# EAGLE design SESSION 5 (EAGLE 9.6.2)
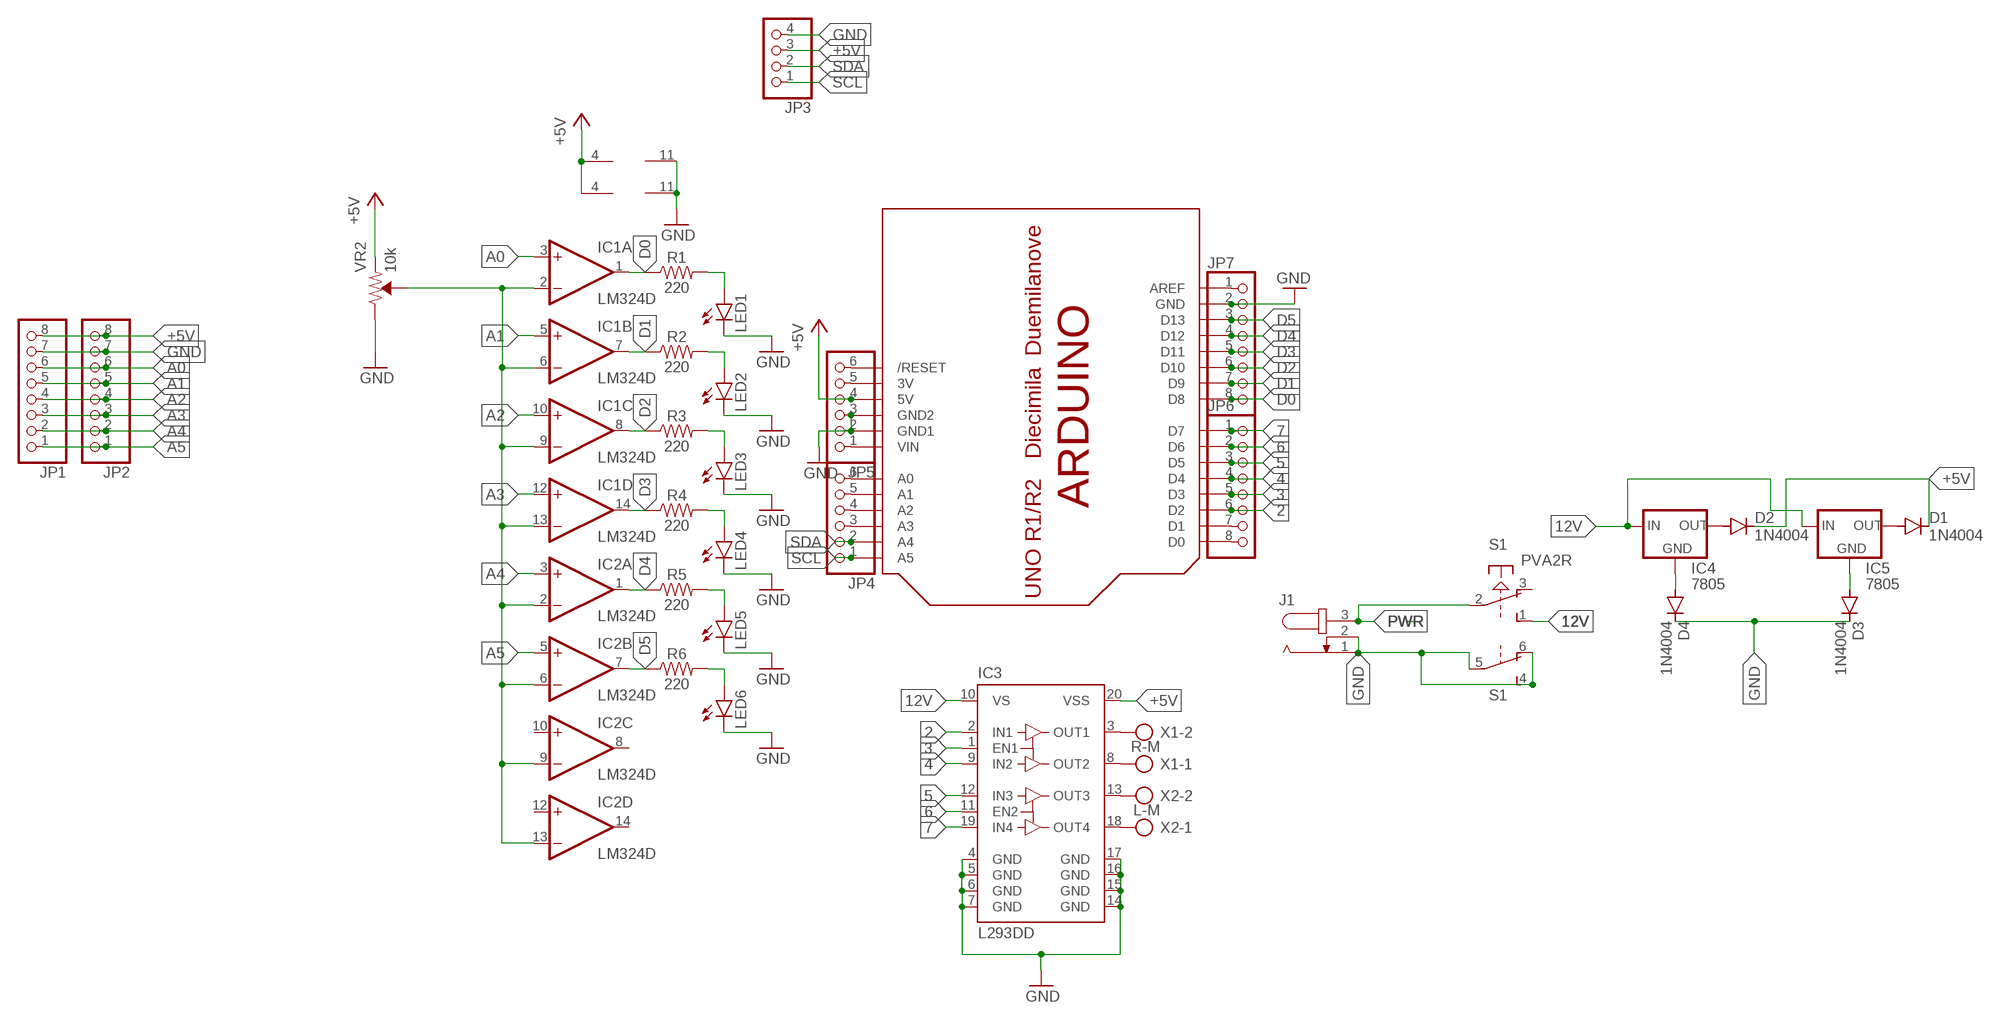
[diagram p0: schematic, sheet 1]

## Parts
D1  1N4004  [DO41-10]
D2  1N4004  [DO41-10]
D3  1N4004  [DO41-10]
D4  1N4004  [DO41-10]
IC1  LM324D  [SO14]
IC2  LM324D  [SO14]
IC3  L293DD  [SO20]
IC4  7805  78XXS  [78XXS]
IC5  7805  78XXS  [78XXS]
J1  JACK-PLUG1  [SPC4078]
JP1  PINHD-1X8  [1X08]
JP2  PINHD-1X8  [1X08]
JP3  PINHD-1X4  [1X04]
JP4  PINHD-1X6  [1X06]
JP5  PINHD-1X6  [1X06]
JP6  PINHD-1X8  [1X08]
JP7  PINHD-1X8  [1X08]
LED1  LEDCHIPLED_0805  [CHIPLED_0805]
LED2  LEDCHIPLED_0805  [CHIPLED_0805]
LED3  LEDCHIPLED_0805  [CHIPLED_0805]
LED4  LEDCHIPLED_0805  [CHIPLED_0805]
LED5  LEDCHIPLED_0805  [CHIPLED_0805]
LED6  LEDCHIPLED_0805  [CHIPLED_0805]
R1  220  RESISTOR1206  [1206]
R2  220  RESISTOR1206  [1206]
R3  220  RESISTOR1206  [1206]
R4  220  RESISTOR1206  [1206]
R5  220  RESISTOR1206  [1206]
R6  220  RESISTOR1206  [1206]
S1  PVA2R  [PVA2R]
U$1  ARDUINO-NODIM  [ARDUINO-NODIM]
VR2  10k  TRIMPOT-PTH-10MM-KNOB-1/2W-10%  [TRIMPOT-PTH-3386U]
X1  R-M  AK500/2-H  [AK500/2-H]
X2  L-M  AK500/2-H  [AK500/2-H]

## Nets
2: IC3.2(IN1) JP6.6 U$1.D2
3: IC3.1(EN1) JP6.5 U$1.D3
4: IC3.9(IN2) JP6.4 U$1.D4
5: IC3.12(IN3) JP6.3 U$1.D5
6: IC3.11(EN2) JP6.2 U$1.D6
7: IC3.19(IN4) JP6.1 U$1.D7
12V: IC3.10(VS) IC4.IN IC5.IN S1.1(1:S)
+5V: D1.C D2.C IC1.4(P:V+) IC2.4(P:V+) IC3.20(VSS) JP1.8 JP2.8 JP3.3 JP5.4 U$1.5V VR2.1(CCW)
A0: IC1.3(A:+IN) JP1.6 JP2.6
A1: IC1.5(B:+IN) JP1.5 JP2.5
A2: IC1.10(C:+IN) JP1.4 JP2.4
A3: IC1.12(D:+IN) JP1.3 JP2.3
A4: IC2.3(A:+IN) JP1.2 JP2.2
A5: IC2.5(B:+IN) JP1.1 JP2.1
D0: IC1.1(A:OUT) JP7.8 R1.1 U$1.D8
D1: IC1.7(B:OUT) JP7.7 R2.1 U$1.D9
D2: IC1.8(C:OUT) JP7.6 R3.1 U$1.D10
D3: IC1.14(D:OUT) JP7.5 R4.1 U$1.D11
D4: IC2.1(A:OUT) JP7.4 R5.1 U$1.D12
D5: IC2.7(B:OUT) JP7.3 R6.1 U$1.D13
GND: D3.C D4.C IC1.11(P:V-) IC2.11(P:V-) IC3.4(GND) IC3.5(GND) IC3.6(GND) IC3.7(GND) IC3.14(GND) IC3.15(GND) IC3.16(GND) IC3.17(GND) J1.1 J1.2 JP1.7 JP2.7 JP3.4 JP5.2 JP5.3 JP7.2 LED1.C LED2.C LED3.C LED4.C LED5.C LED6.C S1.4(2:S) S1.5(2:P) S1.6(2:O) U$1.GND U$1.GND1 U$1.GND2 VR2.3(CW)
N$1: LED1.A R1.2
N$2: IC3.8(OUT2) X1.1
N$3: IC3.3(OUT1) X1.2
N$4: LED2.A R2.2
N$5: IC3.18(OUT4) X2.1
N$6: LED3.A R3.2
N$7: IC3.13(OUT3) X2.2
N$8: LED4.A R4.2
N$10: LED5.A R5.2
N$11: D1.A IC5.OUT
N$12: LED6.A R6.2
N$13: D2.A IC4.OUT
N$14: D4.A IC4.GND
N$15: IC1.2(A:-IN) IC1.6(B:-IN) IC1.9(C:-IN) IC1.13(D:-IN) IC2.2(A:-IN) IC2.6(B:-IN) IC2.9(C:-IN) IC2.13(D:-IN) VR2.2(WIPER)
N$16: D3.A IC5.GND
N$17: JP4.3 U$1.A3
N$18: JP4.4 U$1.A2
N$19: JP4.5 U$1.A1
N$20: JP4.6 U$1.A0
N$22: JP5.1 U$1.VIN
N$23: JP5.5 U$1.3V
N$24: JP5.6 U$1.RESET(/RESET)
N$25: JP6.7 U$1.D1
N$26: JP6.8 U$1.D0
N$27: JP7.1 U$1.AREF
PWR: J1.3 S1.2(1:P)
SCL: JP3.1 JP4.1 U$1.A5
SDA: JP3.2 JP4.2 U$1.A4
Unconnected: IC2.8(C:OUT) IC2.10(C:+IN) IC2.12(D:+IN) IC2.14(D:OUT) S1.3(1:O)

## Library data of the parts
D1-D4 = diode:1N4004: DIODE general purpose rectifier, 1 A
IC1 IC2 = linear:LM324: OP AMP
IC3 = st-microelectronics:L293DD: PUSH-PULL FOUR CHANNEL DRIVER WITH DIODES Source: http://www.st.com/stonline/books/pdf/docs/1330.pdf; OC_FARNELL: unknown
IC4 IC5 = v-reg:78XXS: VOLTAGE REGULATOR
J1 = con-jack:JACK-PLUG: DC POWER JACK Power Jack, DC, Right Angle, Through Hole, Rated 5A at 16VDC, PC Terminals Distributor: Farnell (www.Farnell.de) Drawing: 84N1161.pdf / 84N1162.pdf Manufacturer: SPC Technology (www.spctechnology.com) Type: SPC4077 / SPC 4078; OC_FARNELL: unknown; OC_NEWARK: unknown
JP1 JP2 JP6 JP7 = pinhead:PINHD-1X8: PIN HEADER
JP3 = pinhead:PINHD-1X4: PIN HEADER
JP4 JP5 = pinhead:PINHD-1X6: PIN HEADER
LED1-LED6 = led:LED: LED OSRAM: - CHIPLED LG R971, LG N971, LY N971, LG Q971, LY Q971, LO R971, LY R971 LH N974, LH R974 LS Q976, LO Q976, LY Q976 LO Q996 - Hyper CHIPLED LW Q18S LB Q993, LB Q99A, LB R99A - SideLED LS A670, LO A670, LY A670, LG A670, LP A670 LB A673, LV A673, LT A673, LW A673 LH A674 LY A675 LS A676, LA A676, LO A676, LY A676, LW A676 LS A679, LY A679, LG A679 - Hyper Micro SIDELED® LS Y876, LA Y876, LO Y876, LY Y876 LT Y87S - SmartLED LW L88C, LW L88S LB L89C, LB L89S, LG L890 LS L89K, LO L89K, LY L89K LS L896, LA L896, LO L896, LY L896 - TOPLED LS T670, LO T670, LY T670, LG T670, LP T670 LSG T670, LSP T670, LSY T670, LOP T670, LYG T670 LG T671, LOG T671, LSG T671 LB T673, LV T673, LT T673, LW T673 LH T674 LS T676, LA T676, LO T676, LY T676, LB T676, LH T676, LSB T676, LW T676 LB T67C, LV T67C, LT T67C, LS T67K, LO T67K, LY T67K, LW E67C LS E67B, LA E67B, LO E67B, LY E67B, LB E67C, LV E67C, LT E67C LW T67C LS T679, LY T679, LG T679 LS T770, LO T770, LY T770, LG T770, LP T770 LB T773, LV T773, LT T773, LW T773 LH T774 LS E675, LA E675, LY E675, LS T675 LS T776, LA T776, LO T776, LY T776, LB T776 LHGB T686 LT T68C, LB T68C - Hyper Mini TOPLED® LB M676 - Mini TOPLED Santana® LG M470 LS M47K, LO M47K, LY M47K Source: http://www.osram.convergy.de LUXEON: - LUMILED® LXK2-PW12-R00, LXK2-PW12-S00, LXK2-PW14-U00, LXK2-PW14-V00 LXK2-PM12-R00, LXK2-PM12-S00, LXK2-PM14-U00 LXK2-PE12-Q00, LXK2-PE12-R00, LXK2-PE12-S00, LXK2-PE14-T00, LXK2-PE14-U00 LXK2-PB12-K00, LXK2-PB12-L00, LXK2-PB12-M00, LXK2-PB14-N00, LXK2-PB14-P00, LXK2-PB14-Q00 LXK2-PR12-L00, LXK2-PR12-M00, LXK2-PR14-Q00, LXK2-PR14-R00 LXK2-PD12-Q00, LXK2-PD12-R00, LXK2-PD12-S00 LXK2-PH12-R00, LXK2-PH12-S00 LXK2-PL12-P00, LXK2-PL12-Q00, LXK2-PL12-R00 Source: www.luxeon.com KINGBRIGHT: KA-3528ASYC Source: www.kingbright.com
R1-R6 = SparkFun-Resistors:RESISTOR: Generic Resistor Package
S1 = switch-misc:PVA2R: ITT SWITCH
U$1 = adafruit:ARDUINO: Arduino Diecimila/Duemilanove Make a shield with ease, this package has all the named pins as well as the two mounting drill holes and an outline of the USB and DC power connector. The outline is on the DIMENSION layer, so if your board house uses it they will cut the outline to match. http://www.ladyada.net/library/pcb/eaglelibrary.html
VR2 = SparkFun-Resistors:TRIMPOT: Trimming Potentiometer (Trimpot) Three-terminal potentiometers, with an adjustable wiper and two adjustable resistors. A pot can be used to create a configurable voltage divider, or as a variable resistor. "Trimpots" are a subset of potentiometers, usually intended for "set-and-forget" applications. They're often more delicate than standard potentiometers - rated for fewer turns. Variants PTH-KNOB - PTH Trimpot w/ finger-adjustable knob Trimpot 10K with Knob <https://www.sparkfun.com/products/9806> (COM-09806) Datasheet <http://www.sparkfun.com/datasheets/Components/General/TSR-3386.pdf> SMD-3MM-CLOSED-FRAME - SMD 3mm Square Closed-Frame Trimpot Used on e.g. EasyDriver - Stepper Motor Driver <https://www.sparkfun.com/products/12779> Datasheet <http://www.bitechnologies.com/pdfs/22.pdf> (22AR10KTR) SMD-5MM - SMD 5mm Square Closed-Frame Trimpot Used on e.g. IOIO-OTG - V2.2 <https://www.sparkfun.com/products/13613> Datasheet <http://www.vishay.com/docs/51008/ts53.pdf> (TS53YL502MR10) SMD-3MM-1/10W-25% - 3mm Square Open-Frame Trimpot Used on e.g. SparkFun Shapeoko <https://www.sparkfun.com/products/13899> Datasheet <http://www.bourns.com/docs/Product-Datasheets/TC33.pdf> (TC33X-2-103E); PROD_ID: RES-09730; SF_SKU: COM-09806
X1 X2 = con-ptr500:AK500/2-H: CONNECTOR Aug. 2004 / PTR Meßtechnik: Die Bezeichnung der Serie AK505 wurde geändert. Es handelt sich hierbei um AK500 in horizontaler Ausführung.; OC_FARNELL: unknown; OC_NEWARK: unknown

## Board
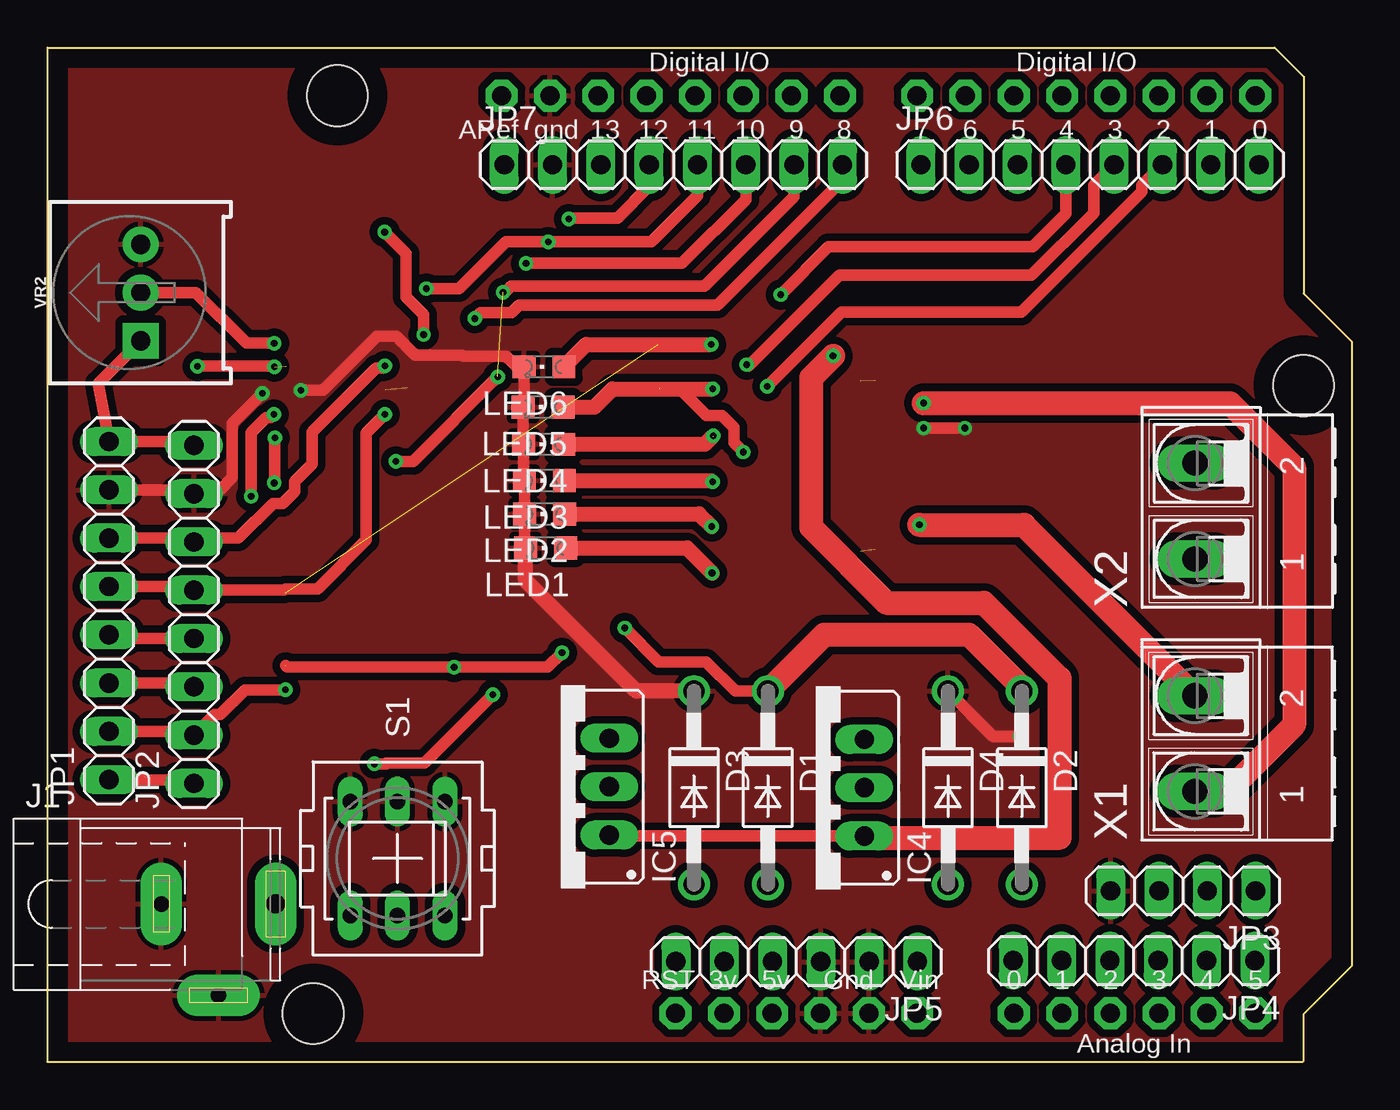
[diagram p1: board, top side]
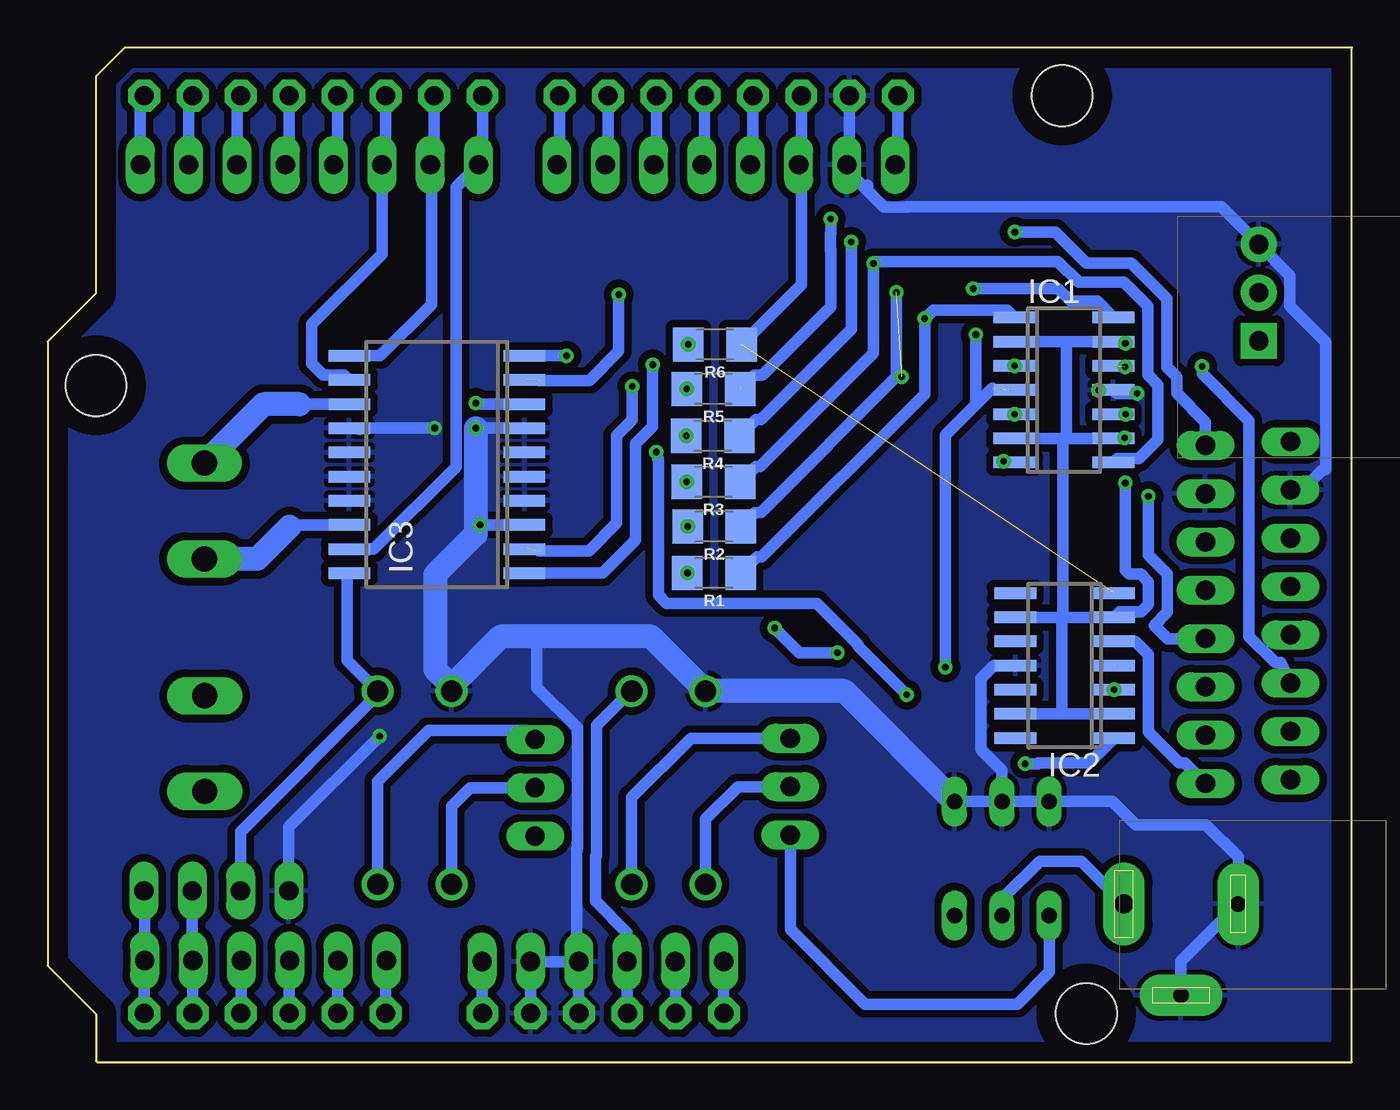
[diagram p2: board, bottom side, seen from below]

Size 68.58 x 53.35 mm. Coordinates in mm from the lower left corner, seen from the top.
Outline: 0,53.35 64.51,53.35 66.03,51.84 66.04,51.84 66.04,40.41 68.57,37.88 68.58,37.88 68.58,5.08 68.58,5.08 66.02,2.52 66.02,0.06 65.96,0 0,0 0,0 0,53.33 0.01,53.34 0.02,53.33 0.02,53.33
Copper layers (1*16): Top 0.035mm / dielectric 1.5mm / Bottom 0.035mm
Design rules "default *": minimum track width 0.6mm, minimum drill 0.2mm, track to track 0.4mm, track to pad 0.4mm, pad to pad 0.4mm, via to via 0.4mm, smd to smd 0.4mm, copper to edge 40mil, drill to drill 6mil, minimum pad ring 10mil, minimum via ring 8mil, stop-mask expansion 4mil, vias tented up to drill 0mil, thermal gap 10mil

### Footprints (pad centres in the part's own frame; a part is rotated, then mirrored left to right if it is on the bottom)
DO41-10 = drill 1.118: A 5.08,0; C -5.08,0
SO14 = smd 0.6 x 2.2: 1 -3.81,-2.6; 2 -2.54,-2.6; 3 -1.27,-2.6; 4 0,-2.6; 5 1.27,-2.6; 6 2.54,-2.6; 7 3.81,-2.6; 8 3.81,2.6; 9 2.54,2.6; 10 1.27,2.6; 11 0,2.6; 12 -1.27,2.6; 13 -2.54,2.6; 14 -3.81,2.6
SO20 = smd 0.6 x 2.2: 1 -5.715,-4.6; 2 -4.445,-4.6; 3 -3.175,-4.6; 4 -1.905,-4.6; 5 -0.635,-4.6; 6 0.635,-4.6; 7 1.905,-4.6; 8 3.175,-4.6; 9 4.445,-4.6; 10 5.715,-4.6; 11 5.715,4.6; 12 4.445,4.6; 13 3.175,4.6; 14 1.905,4.6; 15 0.635,4.6; 16 -0.635,4.6; 17 -1.905,4.6; 18 -3.175,4.6; 19 -4.445,4.6; 20 -5.715,4.6
78XXS = drill 1.016 long: GND 0,-2.54; IN -2.54,-2.54; OUT 2.54,-2.54
SPC4078 = drill 0.8 pad 2.184 long: 1 -3,0; 2 0,-4.8 | drill 1 pad 2.184 long: 3 3,0
1X08 = drill 1.016 long: 1 -8.89,0; 2 -6.35,0; 3 -3.81,0; 4 -1.27,0; 5 1.27,0; 6 3.81,0; 7 6.35,0; 8 8.89,0
1X04 = drill 1.016 long: 1 -3.81,0; 2 -1.27,0; 3 1.27,0; 4 3.81,0
1X06 = drill 1.016 long: 1 -6.35,0; 2 -3.81,0; 3 -1.27,0; 4 1.27,0; 5 3.81,0; 6 6.35,0
CHIPLED_0805 = smd 1.2 x 1.2: A 0,-1.05; C 0,1.05
1206 = smd 1.6 x 1.8: 1 -1.4,0; 2 1.4,0
PVA2R = drill 0.813 long: 1 -2.997,2.489; 2 -2.997,0; 3 -2.997,-2.489; 4 2.997,2.489; 5 2.997,0; 6 2.997,-2.489
ARDUINO-NODIM = drill 1 pad 1.676 octagon: 3V 35.56,2.54; 5V 38.1,2.54; A0 50.8,2.54; A1 53.34,2.54; A2 55.88,2.54; A3 58.42,2.54; A4 60.96,2.54; A5 63.5,2.54; AREF 23.876,50.8; D0 63.5,50.8; D1 60.96,50.8; D2 58.42,50.8; D3 55.88,50.8; D4 53.34,50.8; D5 50.8,50.8; D6 48.26,50.8; D7 45.72,50.8; D8 41.656,50.8; D9 39.116,50.8; D10 36.576,50.8; D11 34.036,50.8; D12 31.496,50.8; D13 28.956,50.8; GND 26.416,50.8; GND1 43.18,2.54; GND2 40.64,2.54; RESET 33.02,2.54; VIN 45.72,2.54 | hole 3.2: 15.24,50.8; 66.04,35.56; 13.97,2.54
TRIMPOT-PTH-3386U = drill 1.016 pad 1.88 square: 1 -2.54,-0.015 | drill 1.016 pad 1.88: 2 0,-0.015; 3 2.54,-0.015
AK500/2-H = drill 1.321 long: 1 -2.515,0; 2 2.515,0

### Placement (x,y rotation side)
D1  37.87,14.43 270 top
D2  51.22,14.43 270 top
D3  33.98,14.43 270 top
D4  47.34,14.43 270 top
IC1  15.14,35.35 270 bottom
IC2  15.1,20.86 90 bottom
IC3  48.11,31.43 90 bottom
IC4  40.4,14.43 90 top
IC5  26.99,14.49 90 top
J1  8.98,8.32 0 top
JP1  3.23,23.74 90 top
JP2  7.7,23.55 90 top
JP3  59.7,9.02 180 top
JP4  57.12,5.34 180 top
JP5  39.38,5.29 180 top
JP6  54.81,47.19 0 top
JP7  32.9,47.19 0 top
LED1  26.19,27.04 90 top
LED2  26.13,28.83 90 top
LED3  26.12,30.58 90 top
LED4  26.07,32.49 90 top
LED5  26.05,34.44 90 top
LED6  26.09,36.56 90 top
R1  33.53,25.72 180 bottom
R2  33.53,28.17 180 bottom
R3  33.56,30.51 180 bottom
R4  33.6,32.93 180 bottom
R5  33.56,35.4 180 bottom
R6  33.49,37.74 180 bottom
S1  18.4,10.71 90 top
U$1  0,0.02 0 top
VR2  4.89,40.47 90 top
X1  60.31,16.76 90 top
X2  60.33,28.98 90 top

### Tracks (layer width: path | path; a pad name or v marks a point on that pad's centre or on a via)
2  (via drill 0.35)  (1 unrouted)
  Top 0.6: JP6.6 57.54,46.11 57.54,45.78 51.2,39.44 41.74,39.44 v37.84,35.55
  Bottom 0.6: U$1.D2 58.62,50.62 JP6.6 | 42.73,26.88 40.12,26.88 38.66,28.35 38.66,32.95 37.84,33.76 v37.84,35.55
3  (via drill 0.35)
  Top 0.6: JP6.5 55,46.11 55,44.66 51.73,41.38 41.62,41.38 36.86,36.62 36.83,36.62 v36.76,36.68
  Bottom 0.6: U$1.D3 55.88,47.39 JP6.5 | IC3.1 39.39,25.71 37.66,27.45 37.66,32.53 36.76,33.43 v36.76,36.68
4  (via drill 0.35)  (1 unrouted)
  Top 0.6: JP6.4 53.54,44.61 51.81,42.88 41.07,42.88 v38.55,40.36 | v38.55,40.36
  Bottom 0.6: U$1.D4 53.34,47.39 JP6.4 | v38.55,40.36 38.55,37.38 40.08,35.85 42.75,35.85
5
  Bottom 0.6: U$1.D5 50.8,47.39 JP6.3 51,42.49 54.69,38.8 54.69,36.73 54.1,36.14 52.98,36.14 IC3.12
6
  Bottom 0.6: 48.4,47.13 JP6.2 | U$1.D6 48.26,47.27 48.4,47.13 | IC3.11 51.09,37.14 48.4,39.84 48.4,47.13
7
  Bottom 0.6: U$1.D7 45.72,47.39 JP6.1 47.11,46 47.11,31.3 51.43,26.98 IC3.19
12V  (via drill 0.35)
  Top 0.6: IC4.IN 29.59,11.89 IC5.IN
  Top 1.27: v41.29,37.14 40.14,35.98 40.14,28.13 44.11,24.16 49.23,24.16 53.2,20.19 53.2,11.8 43.04,11.8 IC4.IN
  Bottom 0.6: IC3.10 v41.3,37.14 v41.29,37.14 | S1.1 15.91,4.75 17.6,3.05 25.6,3.05 29.53,6.98 IC5.IN
+5V  (via drill 0.35)  (2 unrouted)
  Top 0.6: JP2.8 7.5,32.63 JP1.8 2.67,35.69 VR2.1 | v30.35,22.83 32.13,21.05 34.62,21.05 36.16,19.51 D1.C | 12.51,20.85 12.59,20.78 v21.37,20.78 26.29,20.78 v27.05,21.53 | v17.72,43.65 18.85,42.53 18.85,40.23 19.77,39.3 v19.77,38.26
  Top 1.27: D1.C 40.84,22.49 48.44,22.49 51.22,19.7 D2.C
  Bottom 0.6: IC3.20 52.83,25.59 52.83,21.12 D2.C 51.22,19.33 58.43,12.12 JP3.3 | U$1.5V 38.11,2.58 JP5.4 38.11,6.81 39.78,8.48 39.78,10.82 39.72,10.87 39.72,17.7 37.91,19.51 D1.C | v21.37,20.78 21.37,32.97 19.77,34.58 | 19.77,34.58 18.9,35.44 | v27.05,21.53 29.04,21.53 v30.35,22.83 | JP2.8 7.7,33.66 9.21,35.17 9.21,36.03 9.74,36.56 9.74,40.16 11.59,42.01 13.95,42.01 15.6,43.65 v17.72,43.65 | v19.77,38.26 19.77,34.58
  other vias: 7.7,32.44
A0  (via drill 0.35)
  Top 0.6: JP1.6 7.5,27.55 | 7.5,27.55 JP2.6 | IC1.3 17.62,36.49 17.27,36.49 13.92,33.14 13.92,31.45 12.99,30.52 12.99,30.01 12.36,29.38 11.85,29.38 10.02,27.55 7.5,27.55
  other vias: 17.74,36.62
A1  (via drill 0.35)
  Top 0.6: JP1.5 7.63,25.01 JP2.5 12.45,24.82 12.52,24.9 14.2,24.9 16.75,27.45 16.75,33.09 IC1.5
  other vias: 17.74,34.08
A2  (via drill 0.35)
  Top 0.6: JP1.4 2.86,22.28 JP2.4 | v11.9,34.07 11.73,33.9 11.5,33.9 10.71,33.11 v10.71,29.76
  Bottom 0.6: IC1.10 v11.9,34.07 | JP2.4 7.71,22.26 9.69,22.26 10.4,22.97 9.7,23.66 9.7,25.67 10.71,26.68 v10.71,29.76
A3  (via drill 0.35)  (1 unrouted)
  Top 0.6: JP1.3 7.5,19.93 JP2.3 | v7.88,36.59 11.9,36.59 v11.93,36.56
  Bottom 0.6: v7.88,36.59 7.88,36.21 5.42,33.74 5.42,22.39 4.03,21.01 3.75,21.01 JP1.3
A4  (via drill 0.35)
  Top 0.6: JP1.2 7.5,17.39 JP2.2 8.77,18.28 9.06,18.28 10.38,19.59 IC2.3
  other vias: 12.5,19.59
A5
  Top 0.6: JP1.1 7.5,14.85 JP2.1
  Bottom 0.6: JP2.1 8.77,15.74 9.06,15.74 10.7,17.37 10.7,21.45 11.38,22.13 IC2.5
D0  (via drill 0.35)
  Top 0.6: v22.46,39.1 22.76,39.41 24.39,39.41 24.79,39.8 35.22,39.8 41.79,46.37 JP7.8
  Bottom 0.6: U$1.D8 41.65,47.33 JP7.8 | R1.1 31.29,26.57 31.04,26.57 22.46,35.14 v22.46,39.1 22.01,39.55 18.14,39.55 IC1.1
D1  (via drill 0.35)  (1 unrouted)
  Top 0.6: JP7.7 39.25,45.51 34.54,40.8 24.38,40.8 24.06,40.48 v23.95,40.48 | v18.31,31.59 19.22,31.59 v23.67,36.04
  Bottom 0.6: U$1.D9 39.11,47.33 JP7.7 | R2.1 31.38,28.91 31.07,28.91 23.95,36.04 v23.95,40.48 | IC1.7 18.25,31.54 v18.31,31.59
D2  (via drill 0.35)
  Top 0.6: v25.16,42.01 33.37,42.01 36.71,45.36 JP7.6
  Bottom 0.6: U$1.D10 36.57,47.33 JP7.6 | R3.1 31.34,31.33 31.11,31.33 25.16,37.29 v25.16,42.01 25.07,42.11 15.47,42.11 14.37,41.01 12,41.01 10.74,39.75 10.74,36.15 10.21,35.62 10.21,32.75 11.21,31.75 12.33,31.75 IC1.8
D3  (via drill 0.35)
  Top 0.6: JP7.5 34.17,45.55 31.75,43.13 v26.33,43.13 24.11,43.13 21.65,40.68 v19.92,40.68
  Bottom 0.6: U$1.D11 34.03,47.33 JP7.5 | R4.1 31.34,33.8 31.07,33.8 26.33,38.55 v26.33,43.13 | IC1.14 13.39,40.01 14.78,40.01 15.45,40.68 v19.92,40.68
D4  (via drill 0.35)  (1 unrouted)
  Top 0.6: v27.4,44.35 27.45,44.39 29.96,44.39 31.63,46.06 JP7.4 | v17.17,15.69 17.79,15.69 17.84,15.73 19.82,15.73 v23.41,19.33 | 32.17,35.45 33.21,35.45 34.65,34.01 35.45,34.01 36.08,33.38 36.08,32.59 v36.58,32.09
  Bottom 0.6: U$1.D12 31.49,47.33 JP7.4 | R5.1 31.42,36.14 31,36.14 27.4,39.74 27.4,42.69 27.4,43.58 v27.4,44.35 | v17.17,15.69 16.52,15.69 16.47,15.73 13.82,15.73 IC2.1 | v23.41,19.33 25.97,21.89 25.97,21.98 28.12,24.12 36.02,24.12 36.46,24.56 36.46,31.71 36.5,31.74 36.5,32.01 v36.58,32.09
D5  (1 unrouted)
  Bottom 0.6: U$1.D13 28.95,47.33 | 28.95,47.33 JP7.3 | R6.1 28.95,40.88 28.95,47.33
GND  (via drill 0.35)
  Top 0.6: JP1.7 7.5,30.09 | 7.5,30.09 JP2.7 | v46.07,33.34 v48.23,33.34 | D4.C 49.7,17.14 v51.12,17.14 | LED1.C 25.08,27.1 LED2.C 25.07,28.84 LED3.C 25.02,30.63 LED4.C 25,32.51 LED5.C 25.04,34.49 LED6.C 24.67,36.56 24.11,37.12 21.84,37.12 21.78,37.18 19.32,37.18 18.32,38.18 17.34,38.18 14.5,35.34 v13.32,35.34 | 7.5,30.09 9.07,30.09 9.71,30.73 9.71,33.59 v11.29,35.17
  Top 0.8: LED1.C 25.14,25.32 30.95,19.51 D3.C
  Bottom 0.6: J1.2 8.98,5.32 J1.1 5.98,10.79 7.69,12.49 11.37,12.49 12.58,13.71 S1.4 S1.5 | 18.4,14.13 S1.5 | S1.5 S1.6 | U$1.GND 26.41,47.33 JP7.2 26.55,46.9 25.47,45.82 | 52.69,33.36 IC3.14 | IC3.7 46.06,33.33 v46.07,33.34 | v48.23,33.34 52.08,33.34 52.17,33.25 | v51.12,17.14 55.89,12.37 JP3.4 | U$1.GND1 43.19,2.58 JP5.2 JP5.3 | JP5.3 40.65,2.58 U$1.GND2 | 42.86,22.38 42.86,19.72 40.72,17.58 40.72,11.29 40.78,11.23 40.78,5.41 JP5.3 | v11.29,35.17 12.37,35.17 IC1.11 v13.31,35.35 v13.32,35.34 | S1.5 18.4,15.36 19.5,16.46 19.5,20.18 18.82,20.86 IC2.11 | 25.47,45.82 25.47,46.11 | 2.27,30.43 1.53,31.17 1.37,31.17 1.37,37.87 3.26,39.76 3.26,41.37 VR2.3 6.88,44.99 23.39,44.99 23.41,44.97 24.62,44.97 25.47,45.82
  Bottom 1.27: 47.34,19.8 44.75,22.38 42.86,22.38 36.86,22.38 D3.C 26.69,19.51 S1.6 | 47.34,19.8 D4.C | v46.07,33.34 46.07,27.77 48.2,25.64 48.2,20.66 47.34,19.8
  pour Top: 0,53.36 64.52,53.36 66.03,51.85 66.03,40.42 68.57,37.89 68.57,5.08 68.58,5.08 66.02,2.52 66.02,0.06 65.97,0.01 0,0.01 0,0 0,53.35 0,53.35
  pour Bottom: 0,53.36 64.5,53.36 66.03,51.83 66.03,51.83 66.03,40.42 68.58,37.88 68.58,5.08 68.58,5.07 66.03,2.53 66.03,0.08 65.98,0.02 0,0.02 0,0.02 0,53.35 0,53.35
N$1  (via drill 0.35)
  Top 0.8: LED1.A 33.62,27.04 R1.2
  other vias: 34.93,25.72
N$2  (via drill 0.35)
  Top 1.27: v46.07,34.66 62.16,34.66 65.54,31.28 65.54,17.74 62.04,14.24 X1.1
  Bottom 0.6: IC3.8 46.02,34.6 v46.07,34.66
N$3  (via drill 0.35)
  Top 1.27: v45.84,28.25 51.33,28.25 X1.2
  Bottom 0.6: IC3.3 v45.84,28.25
N$4  (via drill 0.35)
  Top 0.8: LED2.A 34.26,28.83 R2.2
  other vias: 34.93,28.17
N$5
  Bottom 0.6: IC3.18 55.76,28.25 55.86,28.16
  Bottom 1.27: 55.86,28.16 57.55,26.47 X2.1
N$6  (via drill 0.35)
  Top 0.8: LED3.A 34.9,30.58 R3.2
  other vias: 34.96,30.51
N$7
  Bottom 0.6: IC3.13 | IC3.13 55.33,34.6
  Bottom 1.27: 55.33,34.6 57.22,34.6 X2.2
N$8  (via drill 0.35)  (1 unrouted)
  Top 0.8: LED4.A 34.56,32.49 34.98,32.91 | 34.98,32.91
  other vias: 35,32.93
N$10  (via drill 0.35)
  Top 0.8: LED5.A 28.74,34.44 29.7,35.4 R5.2
  other vias: 34.96,35.4
N$11
  Bottom 0.6: IC5.OUT 34.76,17.03 37.87,13.92 D1.A
N$12  (via drill 0.35)
  Top 0.8: LED6.A 28.32,37.74 R6.2
  other vias: 34.89,37.74
N$13
  Bottom 0.6: IC4.OUT 43.42,17.45 48.54,17.45 51.22,14.76 D2.A
N$14
  Bottom 0.6: IC4.GND 46.37,14.43 47.34,13.46 D4.A
N$15  (via drill 0.35)
  Top 0.6: v11.95,32.82 11.95,30.5 v11.91,30.46 | v11.91,37.8 10.46,37.8 7.79,40.47 VR2.2
  Bottom 0.6: 15.02,37.89 IC1.13 12,37.89 v11.91,37.8 | 15.02,37.89 IC1.2 | IC1.9 15.2,32.81 | 15.2,32.81 IC1.6 | 15.02,37.89 15.02,32.99 15.2,32.81 | 15.1,23.4 IC2.6 12.23,23.67 11.11,23.67 10.7,24.08 10.7,25.26 11.11,25.67 11.71,25.67 11.91,25.87 v11.91,30.46 | 15.1,23.4 IC2.9 | IC2.2 15.26,18.32 | 15.26,18.32 IC2.13 | 15.1,23.4 15.26,23.24 15.26,18.32 | IC1.9 12.52,32.82 | IC1.9 11.97,32.81 v11.95,32.82 | 15.2,32.81 15.2,23.5 15.1,23.4
N$16
  Bottom 0.6: 29.64,14.6 IC5.GND 32.29,14.49 33.98,12.8 D3.A
N$17
  Bottom 0.6: U$1.A3 58.39,2.59 JP4.3
N$18
  Bottom 0.6: U$1.A2 55.88,5.31 JP4.4
N$19
  Bottom 0.6: U$1.A1 53.34,5.31 JP4.5
N$20
  Bottom 0.6: U$1.A0 50.8,5.31 JP4.6
N$22
  Bottom 0.6: JP5.1 45.73,2.58 U$1.VIN
N$23
  Bottom 0.6: JP5.5 35.57,2.58 U$1.3V
N$24
  Bottom 0.6: JP5.6 33.03,2.58 U$1.RESET
N$25
  Bottom 0.6: U$1.D1 61.16,50.62 JP6.7
N$26
  Bottom 0.6: U$1.D0 63.7,50.62 JP6.8
N$27
  Bottom 0.6: U$1.AREF 23.87,47.33 JP7.1
PWR
  Bottom 0.6: J1.3 14.23,10.57 16.41,10.57 18.4,8.58 S1.2
SCL
  Bottom 0.6: U$1.A5 63.5,5.31 JP4.1 63.47,8.98 JP3.1
SDA
  Bottom 0.6: JP3.2 60.97,5.38 JP4.2 60.96,5.31 U$1.A4